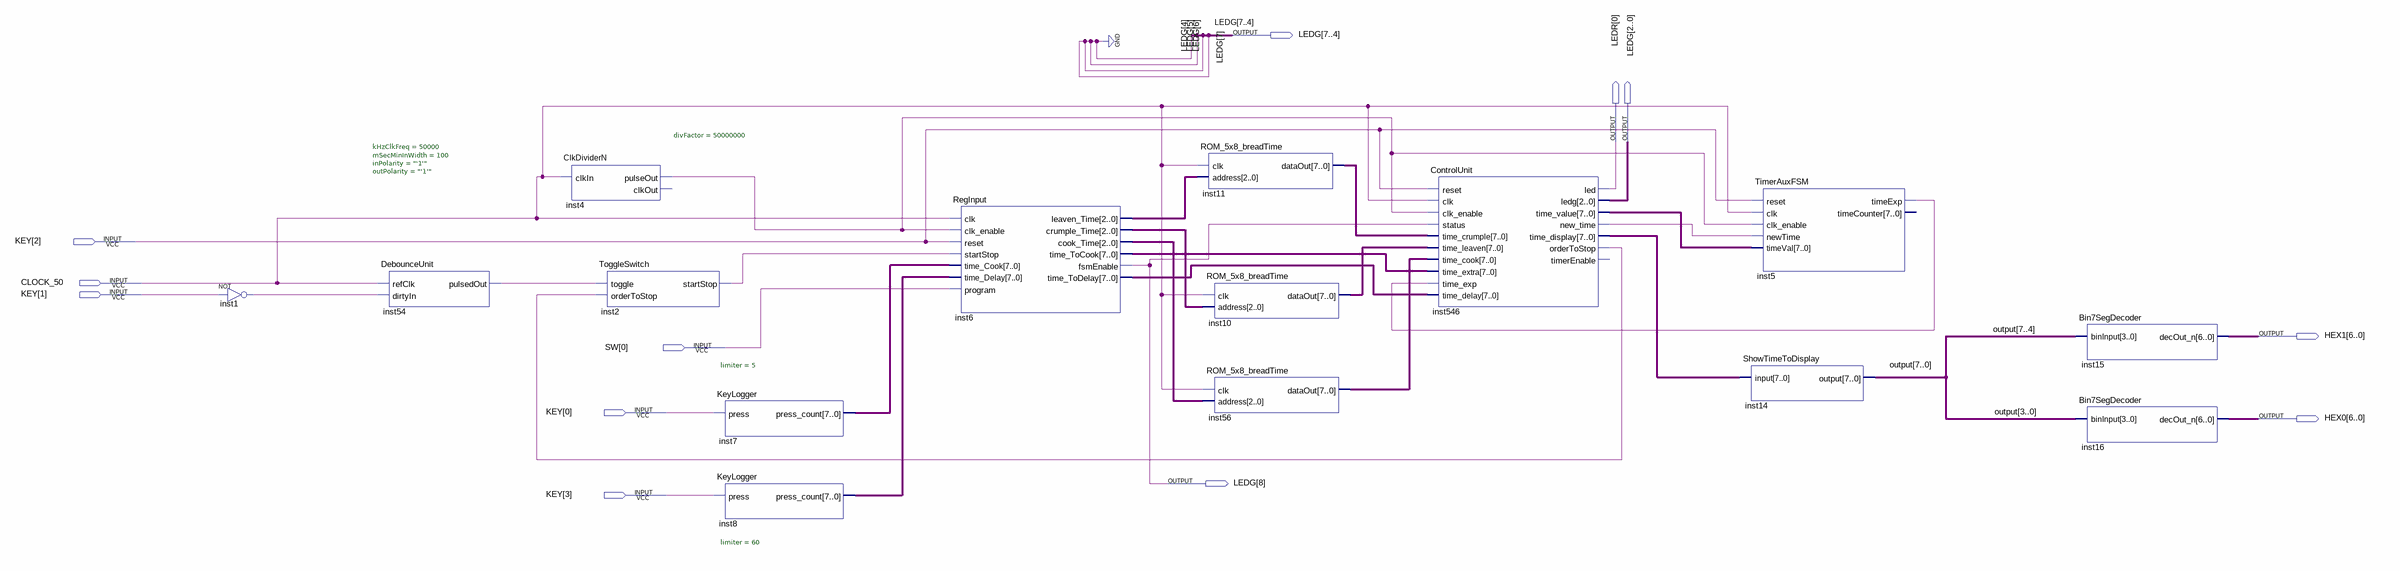
[diagram p0: schematic sheet]
// Quartus schematic Breeeeeeeeeead.bdf as structural Verilog: 15 symbols, 12 pins
module Breeeeeeeeeead (
  input  [3:0] KEY,
  input  CLOCK_50,
  input  [0:0] SW,
  output [8:0] LEDG,
  output [0:0] LEDR,
  output [6:0] HEX1,
  output [6:0] HEX0
);

  wire inst1_out, inst2_startstop, inst4_pulseout, inst5_timeexp, inst54_pulsedout, inst546_new_time,
       inst546_ordertostop;
  wire [2:0] inst6_cook_time, inst6_crumple_time, inst6_leaven_time;
  wire [7:0] inst6_time_tocook, inst6_time_todelay, inst7_press_count, inst8_press_count, inst10_dataout,
       inst11_dataout, inst56_dataout, inst546_time_display, inst546_time_value, \output ;

  not inst1 (inst1_out, KEY[1]);
  DebounceUnit #(.kHzClkFreq(50000), .mSecMinInWidth(100), .inPolarity("'1'"), .outPolarity("'1'")) inst54 (
    .refClk(CLOCK_50), .dirtyIn(inst1_out), .pulsedOut(inst54_pulsedout));
  ClkDividerN #(.divFactor(50000000)) inst4 (.clkIn(CLOCK_50), .pulseOut(inst4_pulseout));  // open: clkOut
  ToggleSwitch inst2 (.toggle(inst54_pulsedout), .orderToStop(inst546_ordertostop), .startStop(inst2_startstop));
  KeyLogger #(.limiter(5)) inst7 (.press(KEY[0]), .press_count(inst7_press_count));
  KeyLogger #(.limiter(60)) inst8 (.press(KEY[3]), .press_count(inst8_press_count));
  RegInput inst6 (
    .clk(CLOCK_50), .clk_enable(inst4_pulseout), .reset(KEY[2]), .startStop(inst2_startstop),
    .time_Cook(inst7_press_count), .time_Delay(inst8_press_count), .\program (SW[0]),
    .leaven_Time(inst6_leaven_time), .crumple_Time(inst6_crumple_time), .cook_Time(inst6_cook_time),
    .time_ToCook(inst6_time_tocook), .fsmEnable(LEDG[8]), .time_ToDelay(inst6_time_todelay));
  ROM_5x8_breadTime inst11 (.clk(CLOCK_50), .address(inst6_leaven_time), .dataOut(inst11_dataout));
  ROM_5x8_breadTime inst10 (.clk(CLOCK_50), .address(inst6_crumple_time), .dataOut(inst10_dataout));
  ROM_5x8_breadTime inst56 (.clk(CLOCK_50), .address(inst6_cook_time), .dataOut(inst56_dataout));
  ControlUnit inst546 (
    .reset(KEY[2]), .clk(CLOCK_50), .clk_enable(inst4_pulseout), .status(LEDG[8]),
    .time_crumple(inst11_dataout), .time_leaven(inst10_dataout), .time_cook(inst56_dataout),
    .time_extra(inst6_time_tocook), .time_exp(inst5_timeexp), .time_delay(inst6_time_todelay), .led(LEDR[0]),
    .ledg(LEDG[2:0]), .time_value(inst546_time_value), .new_time(inst546_new_time),
    .time_display(inst546_time_display), .orderToStop(inst546_ordertostop));  // open: timerEnable
  TimerAuxFSM inst5 (
    .reset(KEY[2]), .clk(CLOCK_50), .clk_enable(inst4_pulseout), .newTime(inst546_new_time),
    .timeVal(inst546_time_value), .timeExp(inst5_timeexp));  // open: timeCounter
  ShowTimeToDisplay inst14 (.\input (inst546_time_display), .\output (\output ));
  Bin7SegDecoder inst15 (.binInput(\output [7:4]), .decOut_n(HEX1));
  Bin7SegDecoder inst16 (.binInput(\output [3:0]), .decOut_n(HEX0));

  assign LEDG[7:4] = 4'b0000;
endmodule
